# EAGLE design Node (EAGLE 6.2)
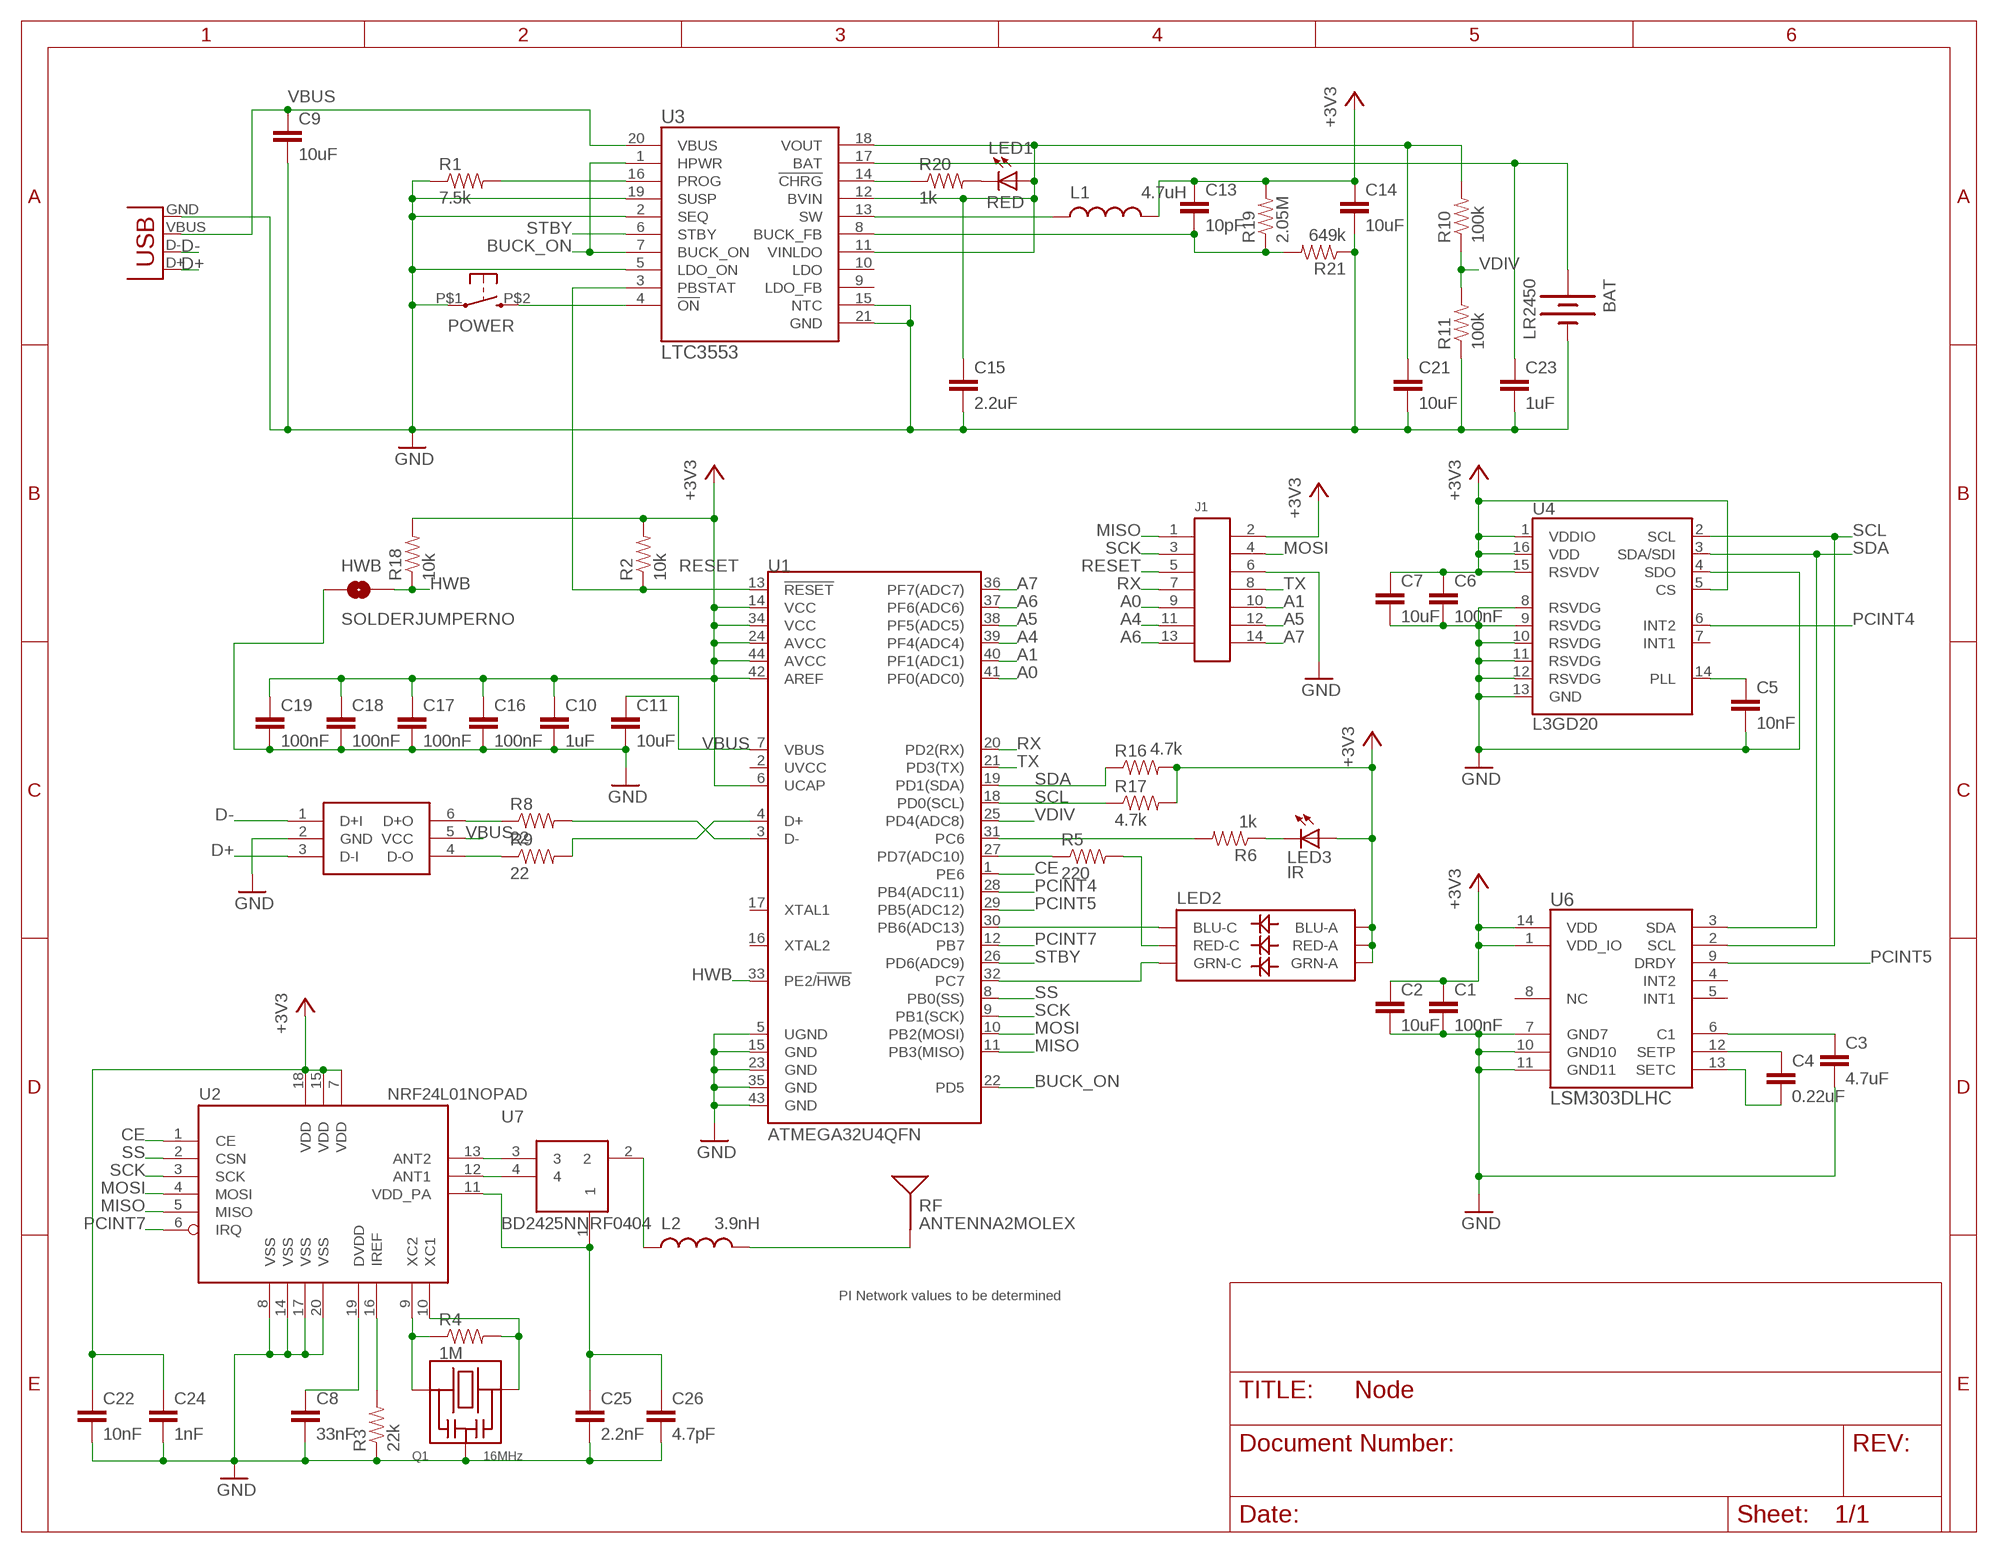
[diagram p0: schematic, sheet 1]

## Parts
BAT  LR2450  BATTERYSLOT  [BATTCON_245MM_SLOT]
C1  100nF  CAP0402-CAP  [0402-CAP]
C2  10uF  CAP0603-CAP  [0603-CAP]
C3  4.7uF  CAP0603-CAP  [0603-CAP]
C4  0.22uF  CAP0402-CAP  [0402-CAP]
C5  10nF  CAP0402-CAP  [0402-CAP]
C6  100nF  CAP0402-CAP  [0402-CAP]
C7  10uF  CAP0603-CAP  [0603-CAP]
C8  33nF  CAP0402-CAP  [0402-CAP]
C9  10uF  CAP0603-CAP  [0603-CAP]
C10  1uF  CAP0402-CAP  [0402-CAP]
C11  10uF  CAP0603-CAP  [0603-CAP]
C13  10pF  CAP0402-CAP  [0402-CAP]
C14  10uF  CAP0603-CAP  [0603-CAP]
C15  2.2uF  CAP0402-CAP  [0402-CAP]
C16  100nF  CAP0402-CAP  [0402-CAP]
C17  100nF  CAP0402-CAP  [0402-CAP]
C18  100nF  CAP0402-CAP  [0402-CAP]
C19  100nF  CAP0402-CAP  [0402-CAP]
C21  10uF  CAP0603-CAP  [0603-CAP]
C22  10nF  CAP0402-CAP  [0402-CAP]
C23  1uF  CAP0402-CAP  [0402-CAP]
C24  1nF  CAP0402-CAP  [0402-CAP]
C25  2.2nF  CAP0402-CAP  [0402-CAP]
C26  4.7pF  CAP0402-CAP  [0402-CAP]
HWB  SOLDERJUMPERNO  [SJ_2S-NO]
J1  DF12A3.0-14DS  [DF12A3.0-14DS]
L1  4.7uH  INDUCTORVLS30  [VLS30]
L2  3.9nH  INDUCTOR0402  [C0402]
LED1  RED  LED0603  [LED-0603]
LED2  LED-TRICOLOR-5050LED-TRICOLOR-0606  [0606]
LED3  IR  LED0603  [LED-0603]
POWER  KSS  [KSS]
Q1  16MHz  RESONATORPRQC  [PRQC]
R1  7.5k  RESISTOR0402-RES  [0402-RES]
R2  10k  RESISTOR0402-RES  [0402-RES]
R3  22k  RESISTOR0402-RES  [0402-RES]
R4  1M  RESISTOR0402-RES  [0402-RES]
R5  220  RESISTOR0402-RES  [0402-RES]
R6  1k  RESISTOR0402-RES  [0402-RES]
R8  22  RESISTOR0402-RES  [0402-RES]
R9  22  RESISTOR0402-RES  [0402-RES]
R10  100k  RESISTOR0402-RES  [0402-RES]
R11  100k  RESISTOR0402-RES  [0402-RES]
R16  4.7k  RESISTOR0402-RES  [0402-RES]
R17  4.7k  RESISTOR0402-RES  [0402-RES]
R18  10k  RESISTOR0402-RES  [0402-RES]
R19  2.05M  RESISTOR0402-RES  [0402-RES]
R20  1k  RESISTOR0402-RES  [0402-RES]
R21  649k  RESISTOR0402-RES  [0402-RES]
RF  ANTENNA2MOLEX  [MOLEX2.4SMD]
U1  ATMEGA32U4QFN  [QFN-44]
U2  NRF24L01NOPAD  [QFN20-NOPAD]
U3  LTC3553  [QFN20-3X3]
U4  L3GD20  [LGA16-4X4]
U6  LSM303DLHC  [LGA14-3X5]
U7  BD2425NNRF0404  [BD2425NNRF]
U9  RCLAMP0502A  [SOT-666]
X1  USB-FCI  [USB-MICROB-FCI]

## Nets
+3V3: C1.1 C2.1 C6.1 C7.1 C10.1 C13.1 C14.1 C16.1 C17.1 C18.1 C19.1 C22.1 C24.1 J1.2 L1.2 LED2.4(BLU-A) LED2.5(RED-A) LED2.6(GRN-A) LED3.A R2.2 R16.2 R17.2 R18.2 R19.2 U1.6(UCAP) U1.14(VCC) U1.24(AVCC) U1.34(VCC) U1.42(AREF) U1.44(AVCC) U2.7(VDD) U2.15(VDD) U2.18(VDD) U4.1(VDDIO) U4.5(CS) U4.15(RSVDV) U4.16(VDD) U6.1(VDD_IO) U6.14(VDD)
A0: J1.9 U1.41(PF0(ADC0))
A1: J1.10 U1.40(PF1(ADC1))
A4: J1.11 U1.39(PF4(ADC4))
A5: J1.12 U1.38(PF5(ADC5))
A6: J1.13 U1.37(PF6(ADC6))
A7: J1.14 U1.36(PF7(ADC7))
BUCK_ON: U1.22(PD5) U3.1(HPWR) U3.7(BUCK_ON)
CE: U1.1(PE6) U2.1(CE)
D+: U9.3(D-I) X1.D+
D-: U9.1(D+I) X1.D-
GND: BAT.GND(-) C1.2 C2.2 C3.2 C5.2 C6.2 C7.2 C8.2 C9.2 C10.2 C11.2 C14.2 C15.2 C16.2 C17.2 C18.2 C19.2 C21.2 C22.2 C23.2 C24.2 C25.2 C26.2 HWB.1 J1.6 POWER.P$1 Q1.P$2(GND) R1.1 R3.1 R11.1 R21.1 U1.5(UGND) U1.15(GND) U1.23(GND) U1.35(GND) U1.43(GND) U2.8(VSS) U2.14(VSS) U2.17(VSS) U2.20(VSS) U3.2(SEQ) U3.5(LDO_ON) U3.15(NTC) U3.19(SUSP) U3.21(GND) U4.4(SDO) U4.8(RSVDG) U4.9(RSVDG) U4.10(RSVDG) U4.11(RSVDG) U4.12(RSVDG) U4.13(GND) U6.7(GND7) U6.10(GND10) U6.11(GND11) U9.2(GND) X1.GND
HWB: HWB.2 R18.1 U1.33(PE2/!HWB)
MISO: J1.1 U1.11(PB3(MISO)) U2.5(MISO)
MOSI: J1.4 U1.10(PB2(MOSI)) U2.4(MOSI)
N$1: C15.1 C21.1 LED1.A R10.2 U3.11(VINLDO) U3.12(BVIN) U3.18(VOUT)
N$2: R1.2 U3.16(PROG)
N$3: C3.1 U6.6(C1)
N$4: R6.2 U1.31(PC6)
N$5: C4.1 U6.12(SETP)
N$6: C4.2 U6.13(SETC)
N$7: C5.1 U4.14(PLL)
N$8: POWER.P$2 U3.4(!ON)
N$9: LED2.2(RED-C) R5.2
N$10: LED3.C R6.1
N$11: C8.1 U2.19(DVDD)
N$12: LED2.3(GRN-C) U1.32(PC7)
N$13: LED1.C R20.2
N$14: R3.2 U2.16(IREF)
N$15: R8.2 U1.3(D-)
N$16: R20.1 U3.14(!CHRG)
N$17: LED2.1(BLU-C) U1.30(PB6(ADC13))
N$18: R5.1 U1.27(PD7(ADC10))
N$19: Q1.P$1 R4.1 U2.9(XC2)
N$20: Q1.P$3 R4.2 U2.10(XC1)
N$21: U2.13(ANT2) U7.3
N$22: U2.12(ANT1) U7.4
N$23: C25.1 C26.1 U2.11(VDD_PA) U7.1
N$24: R9.2 U1.4(D+)
N$25: R8.1 U9.6(D+O)
N$26: R9.1 U9.4(D-O)
N$27: L1.1 U3.13(SW)
N$28: L2.1 U7.2
N$29: BAT.+1(+) BAT.+2(+) BAT.+3(+) BAT.+4(+) C23.1 U3.17(BAT)
N$30: L2.2 RF.FEED(SIGNAL)
N$37: C13.2 R19.1 R21.2 U3.8(BUCK_FB)
PCINT4: U1.28(PB4(ADC11)) U4.6(INT2)
PCINT5: U1.29(PB5(ADC12)) U6.9(DRDY)
PCINT7: U1.12(PB7) U2.6(IRQ)
RESET: J1.5 R2.1 U1.13(!RESET) U3.3(PBSTAT)
RX: J1.7 U1.20(PD2(RX))
SCK: J1.3 U1.9(PB1(SCK)) U2.3(SCK)
SCL: R17.1 U1.18(PD0(SCL)) U4.2(SCL) U6.2(SCL)
SDA: R16.1 U1.19(PD1(SDA)) U4.3(SDA/SDI) U6.3(SDA)
SS: U1.8(PB0(SS)) U2.2(CSN)
STBY: U1.26(PD6(ADC9)) U3.6(STBY)
TX: J1.8 U1.21(PD3(TX))
VBUS: C9.1 C11.1 U1.7(VBUS) U3.20(VBUS) U9.5(VCC) X1.VBUS
VDIV: R10.1 R11.2 U1.25(PD4(ADC8))
Unconnected: U1.2(UVCC) U1.16(XTAL2) U1.17(XTAL1) U3.9(LDO_FB) U3.10(LDO) U4.7(INT1) U6.4(INT2) U6.5(INT1) U6.8(NC)

## Notes on the sheet
- PI Network values to be determined

## Library data of the parts
BAT = adjacent-reality:BATTERY: Battery Holders Various common sizes : AA, AAA, 20mm coin cell and 12mm coin cell.
C1-C11 C13-C19 C21-C26 = SparkFun:CAP: Capacitor Standard 0603 ceramic capacitor, and 0.1" leaded capacitor.
HWB = SparkFun-Passives:SOLDERJUMPER: Solder Jumper Standard SMD solder jumper. Used to automate production. Two varients : Normally Open and Normally Closed are the same, but have different paste layers. NC will have a large amount of paste and should jumper during reflow.
J1 = adjacent-reality:DF12A3.0-14DS
L1 L2 = adjacent-reality:INDUCTOR: Inductors Basic Inductor/Choke - 0603 and 1206. Footprints are not proven and vary greatly between part numbers. CC-BY-SA from SparkFun
LED1 LED3 = SparkFun:LED: LEDs Standard schematic elements and footprints for 5mm, 3mm, 1206, and 0603 sized LEDs. 5mm - Spark Fun Electronics SKU : COM-00529 (and others)
LED2 = adjacent-reality:LED-TRICOLOR-5050
POWER = adjacent-reality:KSS: KSS Series Subminiature SMT Side Actuated Momentary Tactile Switch
Q1 = adjacent-reality:RESONATOR: From UBW USB Bit Whacker by Brian Schmalz
R1-R6 R8-R11 R16-R21 = SparkFun:RESISTOR: Resistor Basic schematic elements and footprints for 0603, 1206, and PTH resistors.
RF = adjacent-reality:ANTENNA2: Chip antenna Single endded antenna. Common with smaller chip antennas. CHIP4 package is the GPS Chip Antenna SKU: GPS-08418. CHIP5 package is 2.4GHz chip antenna SKU: WRL-00144. CC BY SA SparkFun
U1 = adjacent-reality:ATMEGA32U4: CC-BY-SA from SparkFun
U2 = adjacent-reality:NRF24L01: 2.4GHz Low Power Transceiver This is the very popular, low cost, very low power RF transceiver from Nordic Semiconductor. Simple SPI interface. SKU: COM-00690 CC BY SA SparkFun
U3 = adjacent-reality:LTC3553: Micropower USB Power Manager With Li-Ion Charger, LDO and Buck Regulator
U4 = adjacent-reality:L3GD20: The L3GD20 is a low-power three-axis angular rate sensor.
U6 = adjacent-reality:LSM303DLHC: Ultra compact high performance e-compass 3D accelerometer and 3D magnetometer module
U7 = adjacent-reality:BD2425NNRF: Ultra Low Profile 0404 Balun For nRF24L01 and nRF24L01+
U9 = adjacent-reality:RCLAMP0502A: The RailClamp® series consists of ultra low capacitance TVS arrays designed to protect high speed data interfaces.
X1 = adjacent-reality:USB: USB Connectors USB-B-PTH is fully proven SKU : PRT-00139 USB-miniB is fully proven SKU : PRT-00587 USB-A-PCB is untested. USB-A-H is throughly reviewed, but untested. Spark Fun Electronics SKU : PRT-00437 USB-B-SMT is throughly reviewed, but untested. Needs silkscreen touching up. USB-A-S has not been used/tested USB-MB-H has not been used/tested CC BY SA SparkFun

## Board
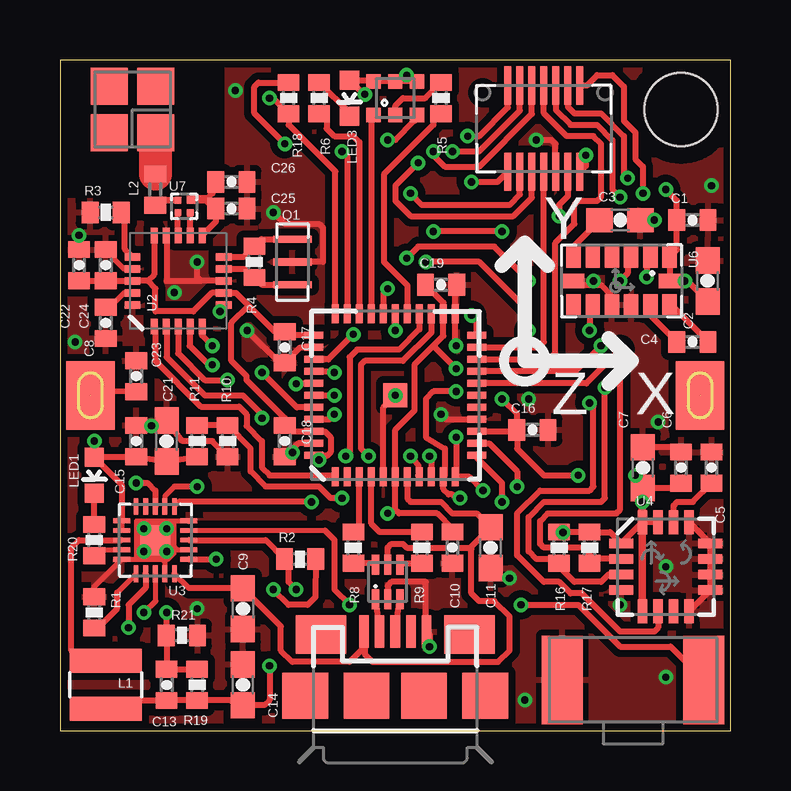
[diagram p1: board, top side]
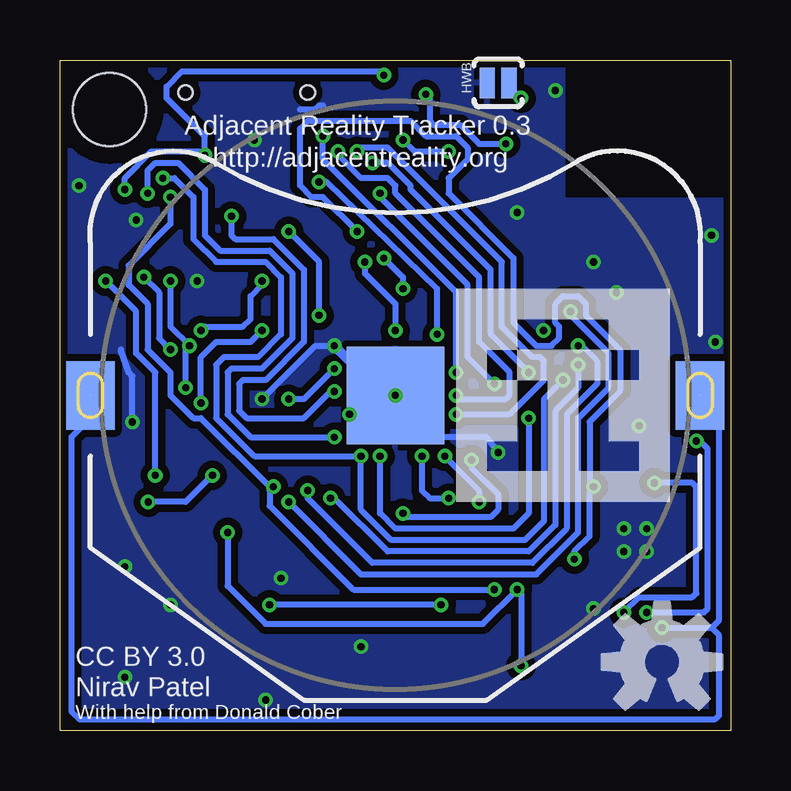
[diagram p2: board, bottom side, seen from below]

Size 27.94 x 27.94 mm. Coordinates in mm from the lower left corner, seen from the top.
Outline: 0,0 27.94,0 27.94,27.94 0,27.94 0,0
Copper layers (1*16): Top 0.035mm / dielectric 1.5mm / Bottom 0.035mm
Design rules: minimum track width 6mil, minimum drill 6mil, track to track 6mil, track to pad 6mil, pad to pad 6mil, via to via 6mil, smd to smd 0mil, copper to edge 10mil, drill to drill 10mil, minimum pad ring 10mil, minimum via ring 6mil, stop-mask expansion 2mil, vias tented up to drill 100mil, thermal gap 10mil

### Footprints (pad centres in the part's own frame; a part is rotated, then mirrored left to right if it is on the bottom)
BATTCON_245MM_SLOT = smd 2.016 x 2.854: +1 -12.7,0; +2 12.7,0 | smd 2.016 x 2.854 bottom: +3 -12.7,0; +4 12.7,0 | smd 4.064 x 4.064: GND 0,0
0402-CAP = smd 0.7 x 0.9: 1 -0.65,0; 2 0.65,0
0603-CAP = smd 1.1 x 1: 1 -0.85,0; 2 0.85,0
SJ_2S-NO = smd 0.635 x 1.27: 1 -0.45,0; 2 0.45,0
DF12A3.0-14DS = smd 0.3 x 1.6: 1 1.5,1.8; 2 1.5,-1.8; 3 1,1.8; 4 1,-1.8; 5 0.5,1.8; 6 0.5,-1.8; 7 0,1.8; 8 0,-1.8; 9 -0.5,1.8; 10 -0.5,-1.8; 11 -1,1.8; 12 -1,-1.8; 13 -1.5,1.8; 14 -1.5,-1.8 | hole 0.6: -2.55,1.5; 2.55,1.5
VLS30 = smd 1 x 3: 1 -1,0; 2 1,0
C0402 = smd 0.7 x 0.9: 1 -0.65,0; 2 0.65,0
LED-0603 = smd 0.8 x 0.8: A 0,-0.75; C 0,0.75
0606 = smd 0.6 x 0.6: 1 -0.7,0.9; 2 -0.7,0; 3 -0.7,-0.9; 4 0.7,0.9; 5 0.7,0; 6 0.7,-0.9
KSS = smd 1.7 x 3.7: P$1 -2.95,0; P$2 2.95,0
PRQC = smd 0.3 x 1.6: P$1 -0.95,0; P$2 0,0; P$3 0.95,0
0402-RES = smd 0.7 x 0.9: 1 -0.65,0; 2 0.65,0
MOLEX2.4SMD = smd 1.54 x 1.54: FEED 0.97,-0.97; FIX1 0.97,0.97; FIX2 -0.97,0.97; FIX3 -0.97,-0.97
QFN-44 = smd 0.8 x 0.3: 1 -3.4,2.5; 2 -3.4,2; 3 -3.4,1.5; 4 -3.4,1; 5 -3.4,0.5; 6 -3.4,0; 7 -3.4,-0.5; 8 -3.4,-1; 9 -3.4,-1.5; 10 -3.4,-2; 11 -3.4,-2.5; 23 3.4,-2.5; 24 3.4,-2; 25 3.4,-1.5; 26 3.4,-1; 27 3.4,-0.5; 28 3.4,0; 29 3.4,0.5; 30 3.4,1; 31 3.4,1.5; 32 3.4,2; 33 3.4,2.5 | smd 0.3 x 0.8: 12 -2.5,-3.4; 13 -2,-3.4; 14 -1.5,-3.4; 15 -1,-3.4; 16 -0.5,-3.4; 17 0,-3.4; 18 0.5,-3.4; 19 1,-3.4; 20 1.5,-3.4; 21 2,-3.4; 22 2.5,-3.4; 34 2.5,3.4; 35 2,3.4; 36 1.5,3.4; 37 1,3.4; 38 0.5,3.4; 39 0,3.4; 40 -0.5,3.4; 41 -1,3.4; 42 -1.5,3.4; 43 -2,3.4; 44 -2.5,3.4 | smd 1 x 1: PAD 0,0
QFN20-NOPAD = smd 0.65 x 0.3: 1 -1.9,1; 2 -1.9,0.5; 3 -1.9,0; 4 -1.9,-0.5; 5 -1.9,-1; 11 1.9,-1; 12 1.9,-0.5; 13 1.9,0; 14 1.9,0.5; 15 1.9,1 | smd 0.3 x 0.65: 6 -1,-1.9; 7 -0.5,-1.9; 8 0,-1.9; 9 0.5,-1.9; 10 1,-1.9; 16 1,1.9; 17 0.5,1.9; 18 0,1.9; 19 -0.5,1.9; 20 -1,1.9
QFN20-3X3 = smd 0.7 x 0.2: 1 -1.4,0.8; 2 -1.4,0.4; 3 -1.4,0; 4 -1.4,-0.4; 5 -1.4,-0.8; 11 1.4,-0.8; 12 1.4,-0.4; 13 1.4,0; 14 1.4,0.4; 15 1.4,0.8 | smd 0.2 x 0.7: 6 -0.8,-1.4; 7 -0.4,-1.4; 8 0,-1.4; 9 0.4,-1.4; 10 0.8,-1.4; 16 0.8,1.4; 17 0.4,1.4; 18 0,1.4; 19 -0.4,1.4; 20 -0.8,1.4 | smd 1.25 x 1.25: 21 0,0
LGA16-4X4 = smd 1 x 0.4: 1 -1.85,0.975; 2 -1.85,0.325; 3 -1.85,-0.325; 4 -1.85,-0.975; 9 1.85,-0.975; 10 1.85,-0.325; 11 1.85,0.325; 12 1.85,0.975 | smd 0.4 x 1: 5 -0.975,-1.85; 6 -0.325,-1.85; 7 0.325,-1.85; 8 0.975,-1.85; 13 0.975,1.85; 14 0.325,1.85; 15 -0.325,1.85; 16 -0.975,1.85
LGA14-3X5 = smd 0.9 x 0.6: 1 -1,2; 2 -1,1.2; 3 -1,0.4; 4 -1,-0.4; 5 -1,-1.2; 6 -1,-2; 8 1,-2; 9 1,-1.2; 10 1,-0.4; 11 1,0.4; 12 1,1.2; 13 1,2 | smd 0.6 x 0.9: 7 0,-2; 14 0,2
BD2425NNRF = smd 0.356 x 0.356: 1 0.292,0.292 | smd 0.279 x 0.279: 2 -0.254,0.254; 3 -0.254,-0.254; 4 0.254,-0.254
SOT-666 = smd 0.305 x 0.838: 1 -0.508,-0.724; 2 0,-0.724; 3 0.508,-0.724; 4 0.508,0.724; 5 0,0.724; 6 -0.508,0.724
STAND-OFF-TIGHT = hole 3.048: 0,0
USB-MICROB-FCI = smd 0.4 x 1.35: D+ 0,2.675; D- -0.65,2.675; GND 1.3,2.675; ID 0.65,2.675; VBUS -1.3,2.675 | smd 1.9 x 1.9: MT1 -3.75,0; MT2 3.75,0; MT3 -1.2,0; MT4 1.2,0 | smd 2.1 x 1.6: MT5 -3.1,2.55; MT6 3.1,2.55

### Placement (x,y rotation side)
BAT  13.97,13.97 0 bottom
C1  26.35,21.27 0 top
C2  26.99,18.73 90 top
C3  23.34,21.27 0 top
C4  26.35,16.19 0 top
C5  27.15,10.95 90 top
C6  25.88,10.95 90 top
C7  24.29,10.95 90 top
C8  1.91,16.99 270 top
C9  7.62,5.08 270 top
C10  16.35,7.62 270 top
C11  17.94,7.62 270 top
C13  4.45,1.91 90 top
C14  7.62,1.91 90 top
C15  3.17,12.06 90 top
C16  19.68,12.53 0 top
C17  9.37,15.97 270 top
C18  9.37,12.06 270 top
C19  15.88,18.57 0 top
C21  4.45,12.06 90 top
C22  0.79,19.39 90 top
C23  3.17,14.76 90 top
C24  1.91,19.39 90 top
C25  7.14,21.75 0 top
C26  7.14,22.86 0 top
HWB  9.68,26.99 0 bottom
J1  20.16,25.08 0 top
L1  1.91,1.91 270 top
L2  3.97,22.54 90 top
LED1  1.43,10.64 180 top
LED2  13.97,26.35 90 top
LED3  12.06,26.35 180 top
POWER  23.88,2.11 0 top
Q1  9.68,19.53 90 top
R1  1.43,4.92 270 top
R2  10,7.14 0 top
R3  1.91,21.59 0 top
R4  8.1,19.53 90 top
R5  15.88,26.35 90 top
R6  10.79,26.35 270 top
R8  12.22,7.62 90 top
R9  15.08,7.62 90 top
R10  5.71,12.06 270 top
R11  6.99,12.06 90 top
R16  20.8,7.62 90 top
R17  22.07,7.62 90 top
R18  9.53,26.35 90 top
R19  5.71,1.91 270 top
R20  1.43,7.94 90 top
R21  5.08,3.97 180 top
RF  3.02,25.88 0 top
U1  13.97,13.97 90 top
U2  4.92,18.73 90 top
U3  3.97,7.94 180 top
U4  25.24,6.83 0 top
U6  23.4,18.73 270 top
U7  5.17,21.84 0 top
U9  13.65,6.19 0 top
U$1  [STAND-OFF-TIGHT]  25.88,25.88 0 top
U$2  [OSHW-LOGO-M]  2.86,2.86 0 bottom
U$3  [ADJACENTREALITY-LOGO-0.35]  6.99,13.97 0 bottom
X1  13.97,1.45 0 top

### Tracks (layer width: path | path; a pad name or v marks a point on that pad's centre or on a via)
+3V3  (via drill 0.3)
  Top 0.203: C24.1 1.95,18.73
  Top 0.254: U4.15 U4.16 U4.1 22.92,8.27 R17.2 R16.2 v20.94,8.27 v20.95,8.26 | L1.2 2.25,1.25 C13.1 R19.2 7.1,1.25 C14.1 8.52,1.05 8.73,1.27 v8.73,2.7 | C22.1 C24.1 | 1.95,18.73 U2.18 3.65,18.73 | U2.15 3.92,19 3.65,18.73 | 3.65,18.73 3.97,18.41 3.97,17.46 5.56,17.46 6.33,18.23 U2.7 7.33,18.23 7.86,17.7 | C10.1 16.35,8.41 15.72,9.05 14.13,9.05 13.97,9.21 | 13.97,9.21 U1.6 13.97,12.54 14.76,13.34 14.76,15.24 15.64,16.11 | U1.44 11.15,11.47 | 11.15,11.47 11.27,11.59 11.27,12.22 11.03,12.47 U1.42 9.61,12.47 C18.1 9.37,13.02 7.78,14.61 7.78,14.76 7.14,15.4 7.14,16.99 7.86,17.7 | U6.14 U6.1 25.7,20.04 C1.1 25.7,22.08 v25.24,22.54 | C2.1 26.14,18.73 U6.14 | U1.34 9.52,16.47 C17.1 8.94,16.62 7.86,17.7 | C19.1 15.97,17.83 U1.24 15.97,16.45 15.64,16.11 | C16.1 18.91,12.47 19.05,12.33 19.05,11.75 20.16,10.64 v21.59,10.64 | 24.27,10.08 C7.1 | C6.1 25.68,10.1 C7.1 | v18.41,13.81 19.04,13.19 C16.1 | R2.2 10.64,5.56 10.32,5.24 9.53,5.24 v8.89,5.87 | v12.7,26.51 12.66,26.51 LED3.A 13.02,27.1 LED2.4 LED2.5 LED2.6 14.62,27.3 v14.45,27.3 | R18.2 8.27,27 8.1,26.83 8.1,25.72 v9.37,24.45 9.53,24.45 | v16.51,15.08 15.64,15.95 15.64,16.11 | v21.91,23.97 21.91,23.53 J1.2 | v24.27,9.53 24.29,9.55 C7.1 | U1.14 18.98,12.47 C16.1 | 11.15,11.47 v10.79,11.27 | v13.65,9.05 13.81,9.05 13.97,9.21 | C7.1 24.29,10.32 v23.97,10.64 | v26.04,18.73 25.56,18.57 U6.14
  Top 0.305: U4.5 U4.16 v24.27,9.53 24.27,10.08
  Bottom 0.254: v16.51,15.08 17.78,13.81 v18.41,13.81 | v8.73,2.7 8.73,5.71 v8.89,5.87 10.32,4.45 19.37,4.45 20.95,6.03 v20.95,8.26 | v12.7,26.51 12.54,26.35 12.54,25.4 12.38,25.24 11.27,25.24 10.48,24.45 v9.37,24.45 | v25.24,22.54 25.24,23.02 24.13,24.13 22.07,24.13 v21.91,23.97 21.91,24.77 23.5,26.35 23.5,26.83 22.86,27.46 14.61,27.46 v14.45,27.3 | v21.59,10.64 22.7,9.53 v24.27,9.53 | v10.79,11.27 10.79,10.95 9.68,9.84 9.68,9.21 10,8.89 13.49,8.89 v13.65,9.05 | v23.97,10.64 23.97,14.92 24.77,15.72 24.77,17.46 v26.04,18.73
A0  (via drill 0.3)
  Top 0.254: U1.41 11.22,12.97 v11.43,13.18 | v15.56,24.13 15.56,23.97 16.03,23.5 17.46,23.5 19.66,25.69 J1.9
  Bottom 0.254: v11.43,13.18 9.21,13.18 7.78,14.61 7.78,15.4 7.94,15.56 8.26,15.56 9.53,16.83 9.53,19.53 14.29,24.29 15.4,24.29 v15.56,24.13
A1  (via drill 0.3)
  Top 0.254: U1.40 9.87,13.47 v8.41,14.92 | v14.92,23.65 13.97,22.7 13.97,22.07 14.61,21.43 18.89,21.43 19.66,22.2 J1.10
  Bottom 0.254: v8.41,14.92 10,16.51 10,19.21 13.34,22.54 13.34,22.7 14.29,23.65 v14.92,23.65
A4  (via drill 0.3)
  Top 0.254: U1.39 v11.43,13.97 | v16.35,24.13 17.46,24.13 19.16,25.83 J1.11
  Bottom 0.254: v11.43,13.97 11.27,13.81 9.37,13.81 9.21,13.97 9.21,14.92 10.48,16.19 10.48,18.89 13.97,22.38 13.97,22.7 14.29,23.02 15.4,23.02 16.35,23.97 v16.35,24.13
A5  (via drill 0.3)
  Top 0.254: U1.38 10.55,14.45 v9.84,14.45 | v14.61,22.38 15.08,21.91 18.73,21.91 19.16,22.34 J1.12
  Bottom 0.254: v9.84,14.45 10.95,15.56 10.95,18.57 14.61,22.23 v14.61,22.38
A6  (via drill 0.3)
  Top 0.254: U1.37 11.32,14.97 v11.43,14.92 | v16.99,24.77 17.46,24.77 18.66,25.96 J1.13
  Bottom 0.254: v11.43,14.92 11.43,18.26 16.99,23.81 v16.99,24.77
A7  (via drill 0.3)
  Top 0.254: 11.03,15.47 U1.36 11.18,15.47 v12.22,16.51 | v17.14,22.86 18.24,22.86 J1.14
  Bottom 0.254: v12.22,16.51 12.22,18.41 16.83,22.86 v17.14,22.86
BUCK_ON  (via drill 0.3)
  Top 0.203: 4.76,10.16 4.37,9.77 U3.7
  Top 0.254: U1.22 17.37,17.08 v17.14,17.3 | v18.41,20.8 v15.56,20.8 | v5.71,10.16 4.76,10.16 | U3.1 v6.51,7.14
  Bottom 0.254: v17.14,17.3 17.14,19.53 v18.41,20.8 | v15.56,20.8 16.99,22.23 17.46,22.23 17.94,22.7 17.94,25.08 17.62,25.4 13.34,25.4 12.7,24.77 11.43,24.77 10.95,24.29 10.95,23.81 11.75,23.02 11.75,22.38 9.05,19.68 9.05,16.99 8.1,16.03 7.46,16.03 7.14,16.35 7.14,16.83 7.3,16.99 7.3,17.78 6.99,18.1 6.35,18.1 6.03,17.78 6.03,17.3 4.6,15.88 4.6,14.13 5.87,12.86 5.87,10.32 v5.71,10.16 5.87,10 5.87,8.1 6.51,7.46 v6.51,7.14
CE
  Top 0.254: U2.1 3.97,16.72 3.97,15.4 5.87,13.49 7.46,13.49 7.78,13.18 7.78,12.7 8.41,12.06 8.41,10.95 8.73,10.64 11.27,10.64 11.34,10.57 U1.1
D+
  Top 0.254: X1.D+ U9.3
D-
  Top 0.254: U9.1 X1.D-
GND  (via drill 0.3)
  Top 0.203: U2.17 2.88,19.23 2.86,19.21 2.7,19.21 1.91,20 C24.2 | 3.49,7.14 U3.15 1.43,6 | 3.49,7.14 3.97,7.62 | 3.49,7.14 4.29,7.14 | 4.37,7.06 U3.19 | 4.84,7.54 U3.2 | U3.5 4.76,8.73 v4.45,8.41 U3.21
  Top 0.254: U4.13 U4.12 U4.11 U4.10 U4.9 U4.8 | v8.89,21.59 9.37,21.11 10.79,21.11 10.95,20.95 10.95,19.53 Q1.P$2 | U2.14 4.45,20.61 4.45,18.73 5.87,18.73 | U2.8 5.87,18.73 | 5.87,18.73 5.71,18.89 v5.71,19.53 | U1.43 9.92,11.97 C18.2 9.21,11.57 v9.68,11.59 | U1.5 13.47,13.47 BAT.GND | C19.2 16.47,18.52 U1.23 16.47,16.07 v16.51,16.03 | U9.2 13.65,6.03 13.81,6.19 15.24,6.19 15.24,4.16 X1.GND 15.4,4 v15.4,3.49 | 3.97,7.62 U3.21 | 4.37,7.06 4.29,7.14 4.76,7.62 4.84,7.54 | U3.5 | J1.6 20.64,23.31 20.64,24.45 20.48,24.61 v19.84,24.61 | C6.2 25.68,11.8 C7.2 | v15.88,13.18 16.08,12.97 U1.15 | U6.7 21.56,18.57 22.54,18.57 23,18.12 U6.10 | U1.35 10.02,15.97 C17.2 9.15,15.32 v7.8,16.67 | R1.1 1.43,6 | R11.1 6.99,11.43 6.35,12.06 5.09,12.06 C21.2
  Top 0.406: v3.81,12.7 4.23,12.7 C21.2
  Bottom 0.254: 14.45,13.97 BAT.GND | v15.88,13.18 15.08,13.97 BAT.GND | v19.53,13.81 17.3,16.03 v16.51,16.03 | v9.68,11.59 10.16,12.22 12.22,12.22 BAT.GND | 16.99,26.04 17.14,26.04 17.3,25.88 17.94,25.88 | 25.4,15.88 25.08,14.92 24.92,14.76 v24.92,12.86
  Bottom 0.406: v16.51,16.03 14.45,13.97
  other vias: 7.3,26.67 0.64,16.19 0.79,20.64 4.76,18.26 13.97,13.97 19.37,1.27 25.24,2.22 25.24,6.83 18.73,6.35 23.34,5.24 3.49,8.41 4.45,7.46 3.49,7.46 5.71,5.08 27.15,22.7 22.23,18.73 24.77,21.27
  pour Top (isolate 0.305): 0,22.07 6.99,22.07 6.99,27.94 27.94,27.94 27.94,0 0,0
  pour Bottom (isolate 0.305): 0,22.07 6.99,22.07 6.99,27.94 27.94,27.94 27.94,0 0,0
HWB  (via drill 0.3)
  Top 0.254: U1.33 11.47,23.3 9.53,25.24 R18.1 8.89,26.34 v8.73,26.35
  Bottom 0.254: v8.73,26.35 9.23,26.86 HWB.2
MISO  (via drill 0.3)
  Top 0.254: U2.5 5.92,16.46 v6.35,16.03 | v17.62,10 17.05,10.57 U1.11 16.51,10.61 v16.51,12.22 | J1.1 21.96,26.88 22.38,27.3 23.02,27.3 23.5,26.83 23.5,25.4 23.97,24.92 23.97,23.81 24.29,23.5 v24.29,22.38
  Bottom 0.254: v6.35,16.03 6.19,16.03 5.56,15.4 5.56,14.45 6.83,13.18 6.83,8.41 8.26,6.99 14.92,6.99 17.62,9.68 v17.62,10 | v16.51,12.22 20,12.22 20.95,13.18 20.95,14.92 20.8,15.08 19.53,15.08 18.26,16.35 18.26,19.05 19.21,20 21.27,20 21.91,20.64 21.91,22.54 23.02,23.65 23.97,23.65 24.29,23.34 v24.29,22.38
MOSI  (via drill 0.3)
  Top 0.254: U2.4 5.4,16.81 5.4,16.03 6.19,15.24 v6.35,15.24 | v16.67,9.68 16.51,9.68 16.35,9.84 16.19,9.84 15.97,10.06 U1.10 16.03,10.63 16.03,11.75 15.24,12.22 15.24,13.81 15.56,14.13 v16.51,14.13 | J1.4 21.16,22.27 20.8,21.91 v20.8,21.43
  Bottom 0.254: v6.35,15.24 6.35,14.29 7.3,13.34 7.3,8.57 8.41,7.46 14.29,7.46 16.51,9.68 v16.67,9.68 | v20.8,21.43 20.8,20.64 20.64,20.48 19.05,20.48 17.78,19.21 17.78,16.19 19.37,14.61 20.32,14.61 20.48,14.45 20.48,13.34 20.16,13.02 17.78,13.02 16.67,14.13 v16.51,14.13
N$1  (via drill 0.3)
  Top 0.203: U3.11 U3.12 | U3.18 3.97,5.4
  Top 0.254: LED1.A 2.57,10.25 U3.11 | 3.97,5.4 v3.49,4.92 | v1.43,12.06 LED1.A | LED1.A 3.15,11.39 C15.1 C21.1 R10.2
  Bottom 0.254: v3.49,4.92 1.11,4.92 0.95,5.08 0.95,11.75 1.27,12.06 v1.43,12.06
N$2
  Top 0.203: 2.38,5.75 U3.16
  Top 0.254: R1.2 1.57,4.27 2.38,5.08 2.38,5.75
N$3
  Top 0.254: C3.1 21.4,20.19 U6.6
N$4
  Top 0.254: R6.2 11.11,25.39 11.11,25.08 11.43,24.77 12.22,24.77 12.47,24.52 U1.31
N$5
  Top 0.254: C4.1 24.6,17.3 U6.12
N$6
  Top 0.254: C4.2 25.46,17.73 U6.13
N$7
  Top 0.254: U4.14 25.57,9.37 25.72,9.53 26.37,9.53 C5.1
N$8  (via drill 0.3)
  Top 0.203: U3.4 11.04,8.34
  Top 0.254: 26.83,1.9 POWER.P$2 25.44,3.49 23.34,3.49 21.59,5.24 v19.21,5.24 | v12.06,5.24 11.43,5.87 11.43,7.94 11.04,8.34
  Bottom 0.254: v12.06,5.24 v19.21,5.24
N$9
  Top 0.254: LED2.2 13.97,26.04 14.29,26.35 15.22,26.35 R5.2
N$10
  Top 0.254: LED3.C 12.06,25.73 R6.1
N$11
  Top 0.203: U2.19 2.67,18.23 2.08,17.64
  Top 0.254: 2.08,17.64 C8.1
N$12  (via drill 0.3)
  Top 0.254: v13.65,24.61 13.97,24.61 14.76,25.4 14.76,25.55 LED2.3 | v11.75,24.13 11.97,23.91 U1.32
  Bottom 0.254: v13.65,24.61 13.18,24.13 v11.75,24.13
N$13
  Top 0.254: R20.2 LED1.C
N$14
  Top 0.203: 2.7,21.45 R3.2
  Top 0.254: U2.16 2.7,20.05 2.7,21.45
N$15
  Top 0.254: R8.2 12.47,8.52 U1.3
N$16
  Top 0.203: R20.1 1.68,7.54 U3.14
N$17
  Top 0.254: LED2.1 12.97,25.55 U1.30
N$18
  Top 0.254: R5.1 15.56,25.39 15.56,25.24 13.49,23.18 13.49,19.53 14.47,18.55 U1.27
N$19
  Top 0.254: U2.9 7.74,19.23 R4.1 8.4,18.58 Q1.P$1
N$20
  Top 0.254: U2.10 7.65,19.73 R4.2 8.4,20.48 Q1.P$3
N$21
  Top 0.203: U2.13
  Top 0.254: U2.13 U7.3
N$22
  Top 0.203: U2.12
  Top 0.254: U2.12 U7.4
N$23
  Top 0.254: C25.1 6.49,21.2 U2.11 | C26.1 6.49,22.84 6.35,22.7 6.35,22.38 6.11,22.14
  Top 0.356: U7.1 6.11,22.14 C25.1
N$24
  Top 0.254: R9.2 13.32,8.27 12.97,8.62 U1.4
N$25
  Top 0.254: U9.6 13.09,6.97 R8.1
N$26
  Top 0.254: U9.4 14.21,6.97 R9.1
N$27
  Top 0.254: L1.1 1.64,3.17 0.64,3.17 0.48,3.33 0.48,7.62 0.79,7.94 U3.13
N$28
  Top 0.203: 4.17,22.1 L2.1
  Top 0.279: U7.2 4.17,22.1
N$29  (via drill 0.3)  (2 unrouted)
  Top 0.254: C23.1 1.43,14.13 BAT.+4 | U3.17 3.57,5.95 2.86,5.24 v2.86,4.29
  Bottom 0.254: v2.86,4.29 0.79,4.29 | 0.79,4.29 0.48,4.6 0.48,13.18 BAT.+4 | BAT.+3 26.67,13.02 27.46,12.22 27.46,0.79 27.15,0.48 0.64,0.48 0.48,0.64 0.48,3.97 0.79,4.29
N$30
  Top 1.384: L2.2 3.99,23.21 RF.FEED
N$37  (via drill 0.3)
  Top 0.254: R19.1 C13.2 4.45,3.95 R21.2 4.45,4.11 v4.45,4.92 | v3.17,10.32 3.65,10.32 3.97,10 U3.8
  Bottom 0.254: v4.45,4.92 3.81,5.56 1.59,5.56 1.43,5.71 1.43,10.16 1.59,10.32 v3.17,10.32
PCINT4  (via drill 0.3)
  Top 0.254: U4.6 24.92,4.29 24.77,4.13 23.34,4.13 21.75,5.71 21.27,5.71 20.8,6.19 20.16,6.19 19.05,7.3 19.05,9.05 20,10 22.07,10 22.23,10.16 22.23,13.49 v22.07,13.65 | v19.53,16.67 19.53,17.46 17.46,19.53 v15.24,19.53 | v13.97,16.67 U1.28
  Bottom 0.254: v22.07,13.65 22.07,15.56 21.43,16.19 20,16.19 v19.53,16.67 | v15.24,19.53 15.24,19.05 13.97,17.78 v13.97,16.67
PCINT5  (via drill 0.3)
  Top 0.254: v19.53,18.73 18.1,20.16 14.92,20.16 v14.45,19.68 | v13.65,18.41 13.47,18.23 U1.29 | 22.23,17.71 U6.9 22.07,17.6 v22.07,16.67
  Bottom 0.254: v14.45,19.68 13.65,18.89 v13.65,18.41 | v22.07,16.67 21.91,16.83 20.32,16.83 20,17.14 20,18.1 19.53,18.57 v19.53,18.73
PCINT7  (via drill 0.3)
  Top 0.254: U1.12 17.37,11.36 18.41,10.32 v18.41,9.53 | v6.67,17.46 6.67,17.58 U2.6
  Bottom 0.254: v18.41,9.53 15.4,6.51 8.1,6.51 6.35,8.26 6.35,13.02 5.08,14.29 5.08,15.72 6.67,17.3 v6.67,17.46
RESET  (via drill 0.3)
  Top 0.254: U1.13 17.88,11.97 19.05,10.79 v19.05,10.16 | U3.3 8.57,7.94 R2.1 9.53,7.13 9.53,6.19 v9.84,5.87 | J1.5 20.66,25.85 21.27,25.24 22.38,25.24 23.02,24.61 23.02,22.54 v23.34,22.23
  Bottom 0.254: v9.84,5.87 15.72,5.87 19.21,9.37 19.21,10 v19.05,10.16 19.21,10.16 22.07,13.02 22.38,13.02 23.34,13.97 23.34,14.92 24.29,15.88 24.29,17.78 25.08,18.57 25.08,19.37 23.34,21.11 v23.34,22.23
RX
  Top 0.254: J1.7 20.16,25.72 21.11,24.77 22.23,24.77 22.54,24.45 22.54,22.23 22.38,22.07 21.59,22.07 21.43,21.91 21.43,21.11 20.64,20.32 20.64,15.72 20.39,15.47 U1.20
SCK  (via drill 0.3)
  Top 0.254: U2.3 4.92,15.72 6.03,14.61 v6.99,14.61 | v15.4,11.43 15.47,11.34 U1.9 | J1.3 21.16,25.99 21.43,25.72 22.54,25.72 23.5,24.77 23.5,23.18 v23.65,23.02
  Bottom 0.254: v6.99,14.61 7.78,13.81 7.78,8.73 8.57,7.94 14.13,7.94 15.4,9.21 v15.4,11.43 19.84,11.43 21.43,13.02 21.43,15.24 21.11,15.56 19.68,15.56 18.73,16.51 18.73,18.89 19.37,19.53 21.43,19.53 22.38,20.48 22.38,22.23 23.18,23.02 v23.65,23.02
SCL  (via drill 0.3)
  Top 0.254: U4.2 22.25,7.15 | 22.25,7.15 R17.1 | U6.2 24.45,19.58 v24.45,18.89 | U1.18 21.93,14.47 v23.34,15.88 23.34,9.21 23.18,9.05 20.32,9.05 20,8.73 20,7.78 20.16,7.62 21.78,7.62 22.25,7.15
  Bottom 0.254: v24.45,18.89 23.81,18.26 23.81,16.35 v23.34,15.88
SDA  (via drill 0.3)
  Top 0.254: U4.3 22.85,6.5 22.54,6.19 21.43,6.19 20.8,6.83 R16.1 20.62,7.14 19.84,7.14 19.53,7.46 19.53,8.89 20.16,9.53 22.54,9.53 22.7,9.68 v22.7,14.29 | U6.3 23.65,19.59 23.65,19.05 v23.34,18.73 | v22.54,16.03 21.48,14.97 U1.19
  Bottom 0.254: v23.34,18.73 23.34,16.83 v22.54,16.03 22.7,15.88 v22.7,14.29
SS  (via drill 0.3)
  Top 0.254: U2.2 4.45,16.81 4.45,15.56 6.03,13.97 7.62,13.97 8.41,13.18 v8.41,13.02 | v14.61,11.43 14.92,11.07 14.92,10.62 U1.8
  Bottom 0.254: v8.41,13.02 8.41,9.05 9.05,8.41 13.97,8.41 14.61,9.05 v14.61,11.43
STBY  (via drill 0.3)
  Top 0.203: 4.96,9.53 U3.6
  Top 0.254: U1.26 14.97,16.72 14.13,15.88 12.38,15.88 12.06,15.56 12.06,11.59 v11.91,11.43 | v10.48,9.53 4.96,9.53
  Bottom 0.254: v11.91,11.43 10.48,10 v10.48,9.53
TX
  Top 0.254: J1.8 20.16,16.19 19.94,15.97 U1.21
VBUS
  Top 0.254: U3.20 5.38,5.93 C9.1 9.21,4.34 9.21,3.33 9.68,2.86 12.06,2.86 12.67,3.46 X1.VBUS 12.7,4.16 12.7,3.17 13.02,2.86 18.26,2.86 18.73,3.33 18.73,4.76 18.1,5.4 17.46,5.4 17.14,5.71 17.14,7.56 17.09,7.62 | U9.5 13.65,7.62 13.81,7.78 14.29,7.78 14.45,7.62 17.09,7.62 | 17.09,7.62 C11.1 17.36,9.05 16.35,9.05 15.88,9.53 14.61,9.53 14.47,9.66 U1.7
VDIV  (via drill 0.3)
  Top 0.254: R10.1 R11.2 7.94,11.75 7.94,10.79 8.57,10.16 10.79,10.16 11.27,9.68 v11.75,9.68 | U1.25 15.47,16.58 14.29,15.4 12.7,15.4 12.54,15.24 12.54,11.75 v12.86,11.43
  Bottom 0.254: v12.86,11.43 12.86,10 12.54,9.68 v11.75,9.68

### Text on the board
tPlace: Y | Z | X
bPlace: Adjacent Reality Tracker 0.3 | http://adjacentreality.org | CC BY 3.0 | Nirav Patel | With help from Donald Cober